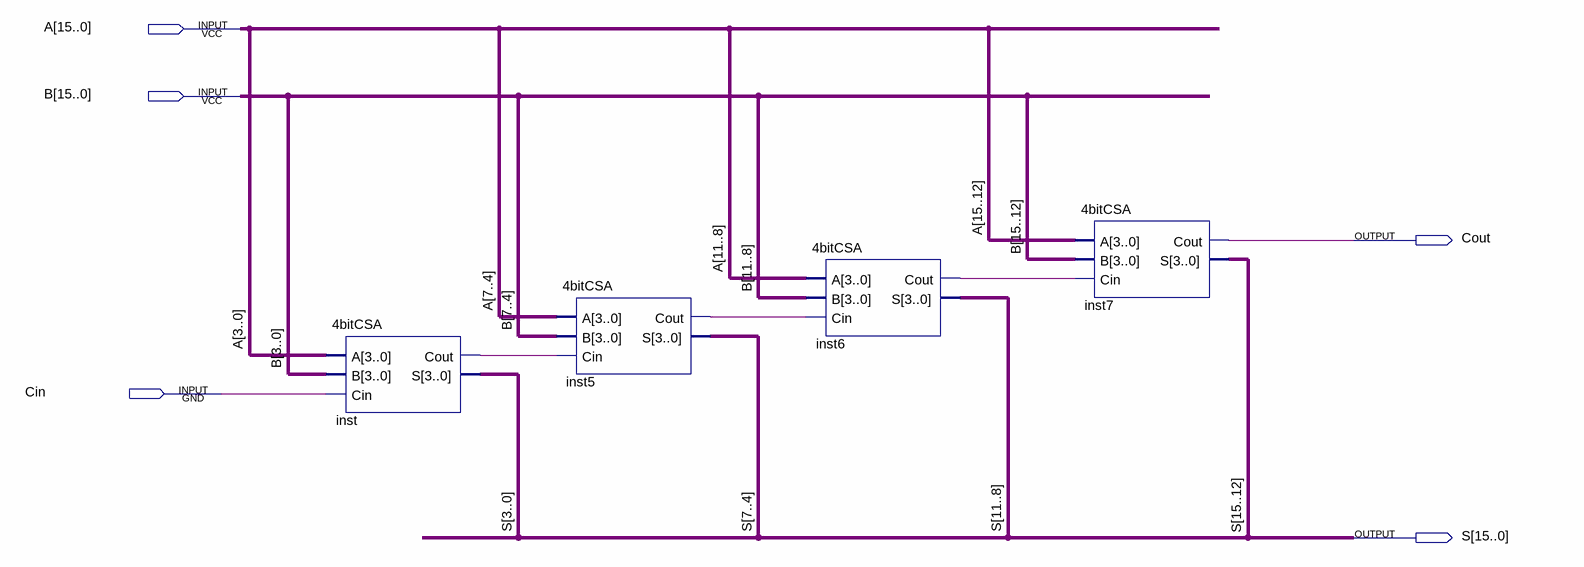
[diagram p0: schematic sheet]
// Quartus schematic 16bitCSA.bdf as structural Verilog: 4 symbols, 5 pins
module \16bitCSA  (
  input  [15:0] A,
  input  [15:0] B,
  input  Cin,
  output Cout,
  output [15:0] S
);

  wire inst5_cout, inst6_cout, inst_cout;

  \4bitCSA  inst (.A(A[3:0]), .B(B[3:0]), .Cin(Cin), .Cout(inst_cout), .S(S[3:0]));
  \4bitCSA  inst5 (.A(A[7:4]), .B(B[7:4]), .Cin(inst_cout), .Cout(inst5_cout), .S(S[7:4]));
  \4bitCSA  inst6 (.A(A[11:8]), .B(B[11:8]), .Cin(inst5_cout), .Cout(inst6_cout), .S(S[11:8]));
  \4bitCSA  inst7 (.A(A[15:12]), .B(B[15:12]), .Cin(inst6_cout), .Cout(Cout), .S(S[15:12]));
endmodule
